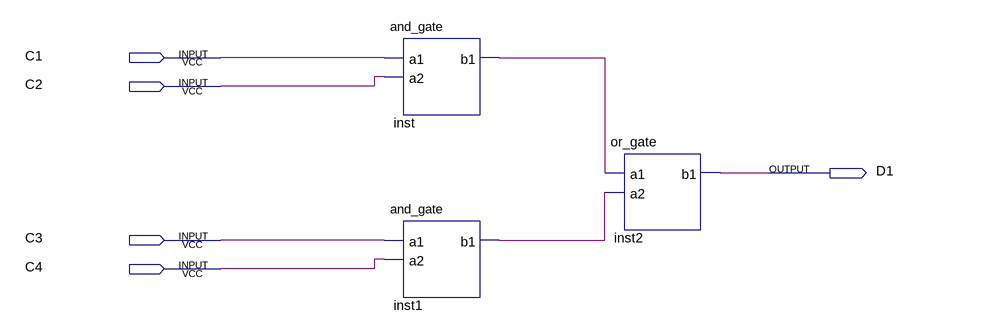
[diagram p0: schematic sheet]
// Quartus schematic work2.bdf as structural Verilog: 3 symbols, 5 pins
module work2 (
  input  C1,
  input  C2,
  input  C3,
  input  C4,
  output D1
);

  wire inst1_b1, inst_b1;

  and_gate inst (.a1(C1), .a2(C2), .b1(inst_b1));
  and_gate inst1 (.a1(C3), .a2(C4), .b1(inst1_b1));
  or_gate inst2 (.a1(inst_b1), .a2(inst1_b1), .b1(D1));
endmodule
